# Altium schematic sheet 1.SchDoc
size A0
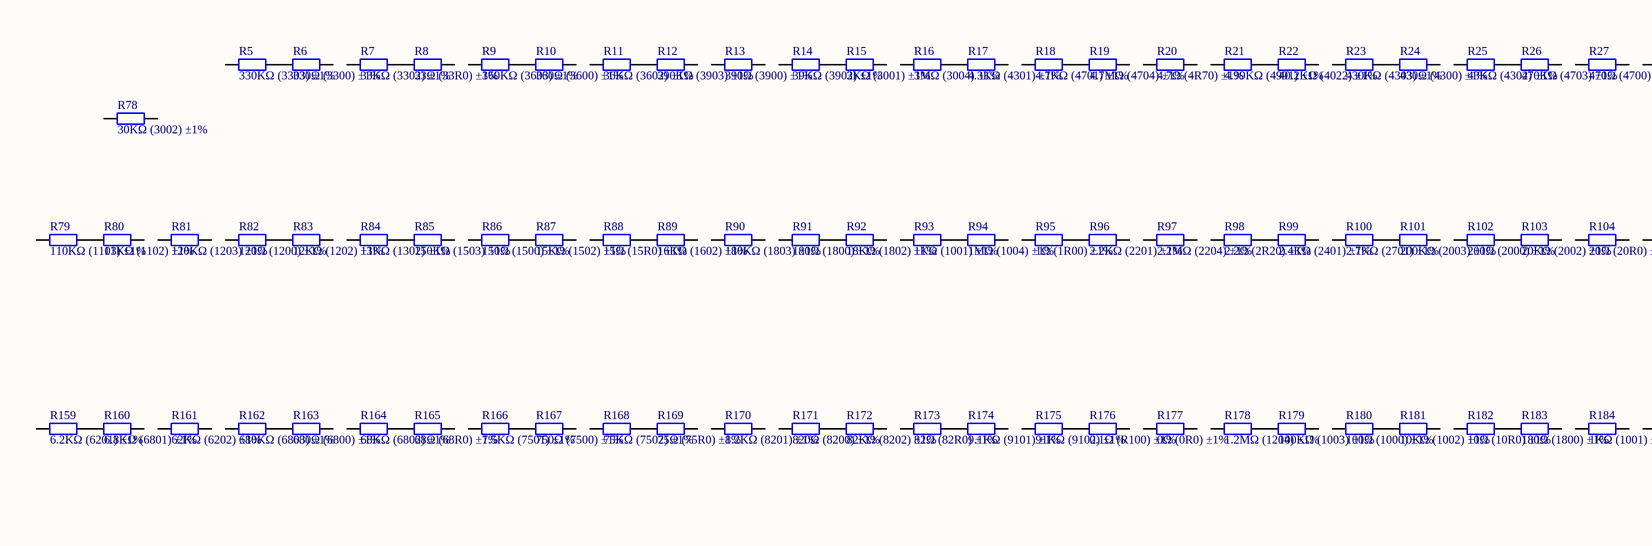
[diagram p0: 1.SchDoc, left]
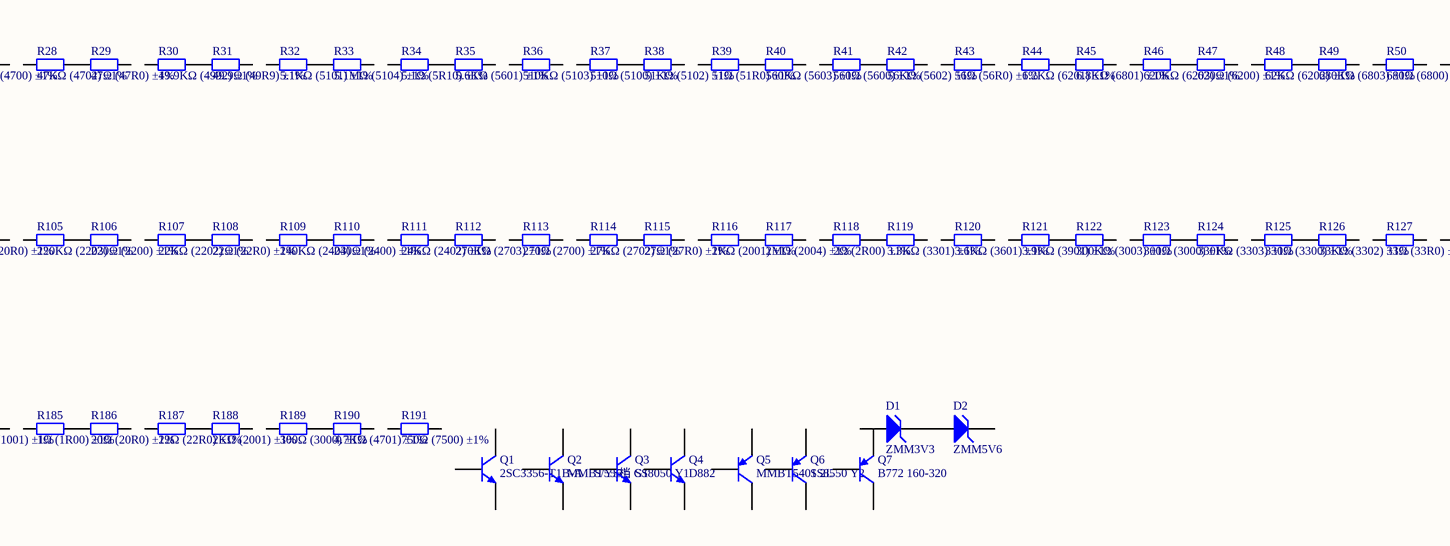
[diagram p1: 1.SchDoc, middle]
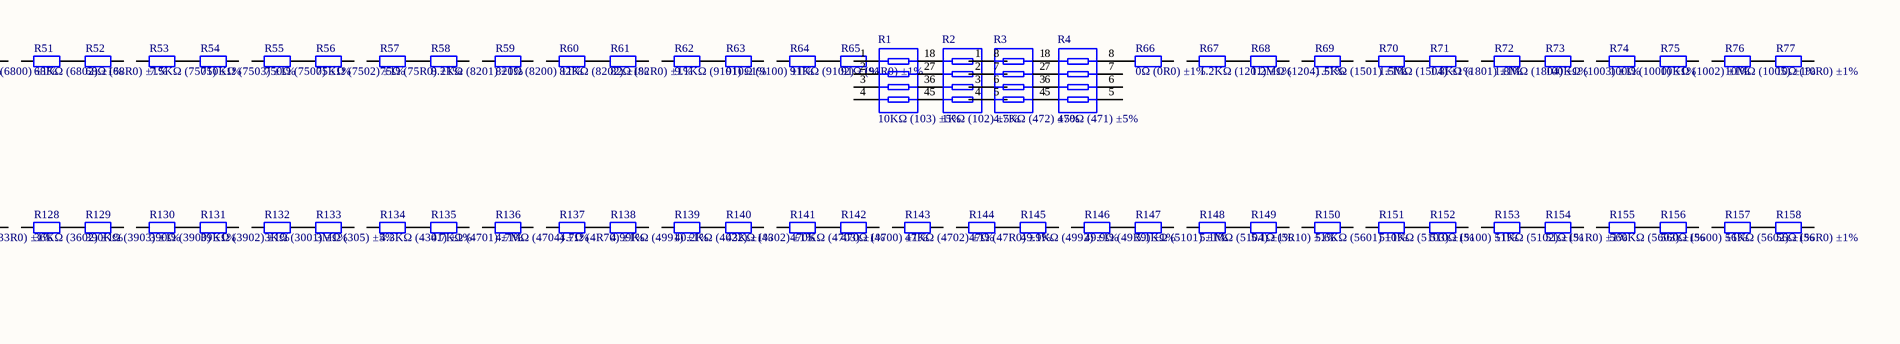
[diagram p2: 1.SchDoc, right]

## Parts
D1  ZMM3V3  [LC-LL-34]
D2  ZMM5V6  [LC-LL-34]
Q1  2SC3356-T1B-A    S/YS档  [LC-SOT-23(SOT-23-3)]
Q2  MMBT5551  G1  [LC-SOT-23(SOT-23-3)]
Q3  SS8050 Y1  [LC-SOT-23(SOT-23-3)]
Q4  D882  [LC-SOT-89(SOT-89-3)]
Q5  MMBT5401 2L  [LC-SOT-23(SOT-23-3)]
Q6  SS8550 Y2  [LC-SOT-23(SOT-23-3)]
Q7  B772 160-320  [LC-SOT-89(SOT-89-3)]
R1  10KΩ (103) ±5%  [LC-0603_Rx4]
R2  1KΩ (102) ±5%  [LC-0603_Rx4]
R3  4.7KΩ (472) ±5%  [LC-0603_Rx4]
R4  470Ω (471) ±5%  [LC-0603_Rx4]
R5  330KΩ (3303) ±1%  [LC-0603_R]
R6  330Ω (3300) ±1%  [LC-0603_R]
R7  33KΩ (3302) ±1%  [LC-0603_R]
R8  33Ω (33R0) ±1%  [LC-0603_R]
R9  360KΩ (3603) ±1%  [LC-0603_R]
R10  360Ω (3600) ±1%  [LC-0603_R]
R11  36KΩ (3602) ±1%  [LC-0603_R]
R12  390KΩ (3903) ±1%  [LC-0603_R]
R13  390Ω (3900) ±1%  [LC-0603_R]
R14  39KΩ (3902) ±1%  [LC-0603_R]
R15  3KΩ (3001) ±1%  [LC-0603_R]
R16  3MΩ (3004) ±1%  [LC-0603_R]
R17  4.3KΩ (4301) ±1%  [LC-0603_R]
R18  4.7KΩ (4701) ±1%  [LC-0603_R]
R19  4.7MΩ (4704) ±1%  [LC-0603_R]
R20  4.7Ω (4R70) ±1%  [LC-0603_R]
R21  4.99KΩ (4991) ±1%  [LC-0603_R]
R22  40.2KΩ (4022) ±1%  [LC-0603_R]
R23  430KΩ (4303) ±1%  [LC-0603_R]
R24  430Ω (4300) ±1%  [LC-0603_R]
R25  43KΩ (4302) ±1%  [LC-0603_R]
R26  470KΩ (4703) ±1%  [LC-0603_R]
R27  470Ω (4700) ±1%  [LC-0603_R]
R28  47KΩ (4702) ±1%  [LC-0603_R]
R29  47Ω (47R0) ±1%  [LC-0603_R]
R30  49.9KΩ (4992) ±1%  [LC-0603_R]
R31  49.9Ω (49R9) ±1%  [LC-0603_R]
R32  5.1KΩ (5101) ±1%  [LC-0603_R]
R33  5.1MΩ (5104) ±1%  [LC-0603_R]
R34  5.1Ω (5R10) ±1%  [LC-0603_R]
R35  5.6KΩ (5601) ±1%  [LC-0603_R]
R36  510KΩ (5103) ±1%  [LC-0603_R]
R37  510Ω (5100) ±1%  [LC-0603_R]
R38  51KΩ (5102) ±1%  [LC-0603_R]
R39  51Ω (51R0) ±1%  [LC-0603_R]
R40  560KΩ (5603) ±1%  [LC-0603_R]
R41  560Ω (5600) ±1%  [LC-0603_R]
R42  56KΩ (5602) ±1%  [LC-0603_R]
R43  56Ω (56R0) ±1%  [LC-0603_R]
R44  6.2KΩ (6201) ±1%  [LC-0603_R]
R45  6.8KΩ (6801) ±1%  [LC-0603_R]
R46  620KΩ (6203) ±1%  [LC-0603_R]
R47  620Ω (6200) ±1%  [LC-0603_R]
R48  62KΩ (6202) ±1%  [LC-0603_R]
R49  680KΩ (6803) ±1%  [LC-0603_R]
R50  680Ω (6800) ±1%  [LC-0603_R]
R51  68KΩ (6802) ±1%  [LC-0603_R]
R52  68Ω (68R0) ±1%  [LC-0603_R]
R53  7.5KΩ (7501) ±1%  [LC-0603_R]
R54  750KΩ (7503) ±1%  [LC-0603_R]
R55  750Ω (7500) ±1%  [LC-0603_R]
R56  75KΩ (7502) ±1%  [LC-0603_R]
R57  75Ω (75R0) ±1%  [LC-0603_R]
R58  8.2KΩ (8201) ±1%  [LC-0603_R]
R59  820Ω (8200) ±1%  [LC-0603_R]
R60  82KΩ (8202) ±1%  [LC-0603_R]
R61  82Ω (82R0) ±1%  [LC-0603_R]
R62  9.1KΩ (9101) ±1%  [LC-0603_R]
R63  910Ω (9100) ±1%  [LC-0603_R]
R64  91KΩ (9102) ±1%  [LC-0603_R]
R65  91Ω (91R0) ±1%  [LC-0603_R]
R66  0Ω (0R0) ±1%  [LC-0805_R]
R67  1.2KΩ (1201) ±1%  [LC-0805_R]
R68  1.2MΩ (1204) ±1%  [LC-0805_R]
R69  1.5KΩ (1501) ±1%  [LC-0805_R]
R70  1.5MΩ (1504) ±1%  [LC-0805_R]
R71  1.8KΩ (1801) ±1%  [LC-0805_R]
R72  1.8MΩ (1804) ±1%  [LC-0805_R]
R73  100KΩ (1003) ±1%  [LC-0805_R]
R74  100Ω (1000) ±1%  [LC-0805_R]
R75  10KΩ (1002) ±1%  [LC-0805_R]
R76  10MΩ (1005) ±1%  [LC-0805_R]
R77  10Ω (10R0) ±1%  [LC-0805_R]
R78  30KΩ (3002) ±1%  [LC-0603_R]
R79  110KΩ (1103) ±1%  [LC-0805_R]
R80  11KΩ (1102) ±1%  [LC-0805_R]
R81  120KΩ (1203) ±1%  [LC-0805_R]
R82  120Ω (1200) ±1%  [LC-0805_R]
R83  12KΩ (1202) ±1%  [LC-0805_R]
R84  13KΩ (1302) ±1%  [LC-0805_R]
R85  150KΩ (1503) ±1%  [LC-0805_R]
R86  150Ω (1500) ±1%  [LC-0805_R]
R87  15KΩ (1502) ±1%  [LC-0805_R]
R88  15Ω (15R0) ±1%  [LC-0805_R]
R89  16KΩ (1602) ±1%  [LC-0805_R]
R90  180KΩ (1803) ±1%  [LC-0805_R]
R91  180Ω (1800) ±1%  [LC-0805_R]
R92  18KΩ (1802) ±1%  [LC-0805_R]
R93  1KΩ (1001) ±1%  [LC-0805_R]
R94  1MΩ (1004) ±1%  [LC-0805_R]
R95  1Ω (1R00) ±1%  [LC-0805_R]
R96  2.2KΩ (2201) ±1%  [LC-0805_R]
R97  2.2MΩ (2204) ±1%  [LC-0805_R]
R98  2.2Ω (2R20) ±1%  [LC-0805_R]
R99  2.4KΩ (2401) ±1%  [LC-0805_R]
R100  2.7KΩ (2701) ±1%  [LC-0805_R]
R101  200KΩ (2003) ±1%  [LC-0805_R]
R102  200Ω (2000) ±1%  [LC-0805_R]
R103  20KΩ (2002) ±1%  [LC-0805_R]
R104  20Ω (20R0) ±1%  [LC-0805_R]
R105  220KΩ (2203) ±1%  [LC-0805_R]
R106  220Ω (2200) ±1%  [LC-0805_R]
R107  22KΩ (2202) ±1%  [LC-0805_R]
R108  22Ω (22R0) ±1%  [LC-0805_R]
R109  240KΩ (2403) ±1%  [LC-0805_R]
R110  240Ω (2400) ±1%  [LC-0805_R]
R111  24KΩ (2402) ±1%  [LC-0805_R]
R112  270KΩ (2703) ±1%  [LC-0805_R]
R113  270Ω (2700) ±1%  [LC-0805_R]
R114  27KΩ (2702) ±1%  [LC-0805_R]
R115  27Ω (27R0) ±1%  [LC-0805_R]
R116  2KΩ (2001) ±1%  [LC-0805_R]
R117  2MΩ (2004) ±1%  [LC-0805_R]
R118  2Ω (2R00) ±1%  [LC-0805_R]
R119  3.3KΩ (3301) ±1%  [LC-0805_R]
R120  3.6KΩ (3601) ±1%  [LC-0805_R]
R121  3.9KΩ (3901) ±1%  [LC-0805_R]
R122  300KΩ (3003) ±1%  [LC-0805_R]
R123  300Ω (3000) ±1%  [LC-0805_R]
R124  330KΩ (3303) ±1%  [LC-0805_R]
R125  330Ω (3300) ±1%  [LC-0805_R]
R126  33KΩ (3302) ±1%  [LC-0805_R]
R127  33Ω (33R0) ±1%  [LC-0805_R]
R128  36KΩ (3602) ±1%  [LC-0805_R]
R129  390KΩ (3903) ±1%  [LC-0805_R]
R130  390Ω (3900) ±1%  [LC-0805_R]
R131  39KΩ (3902) ±1%  [LC-0805_R]
R132  3KΩ (3001) ±1%  [LC-0805_R]
R133  3MΩ (305) ±5%  [LC-0805_R]
R134  4.3KΩ (4301) ±1%  [LC-0805_R]
R135  4.7KΩ (4701) ±1%  [LC-0805_R]
R136  4.7MΩ (4704) ±1%  [LC-0805_R]
R137  4.7Ω (4R70) ±1%  [LC-0805_R]
R138  4.99KΩ (4991) ±1%  [LC-0805_R]
R139  40.2KΩ (4022) ±1%  [LC-0805_R]
R140  43KΩ (4302) ±1%  [LC-0805_R]
R141  470KΩ (4703) ±1%  [LC-0805_R]
R142  470Ω (4700) ±1%  [LC-0805_R]
R143  47KΩ (4702) ±1%  [LC-0805_R]
R144  47Ω (47R0) ±1%  [LC-0805_R]
R145  49.9KΩ (4992) ±1%  [LC-0805_R]
R146  49.9Ω (49R9) ±1%  [LC-0805_R]
R147  5.1KΩ (5101) ±1%  [LC-0805_R]
R148  5.1MΩ (5104) ±1%  [LC-0805_R]
R149  5.1Ω (5R10) ±1%  [LC-0805_R]
R150  5.6KΩ (5601) ±1%  [LC-0805_R]
R151  510KΩ (5103) ±1%  [LC-0805_R]
R152  510Ω (5100) ±1%  [LC-0805_R]
R153  51KΩ (5102) ±1%  [LC-0805_R]
R154  51Ω (51R0) ±1%  [LC-0805_R]
R155  560KΩ (5603) ±1%  [LC-0805_R]
R156  560Ω (5600) ±1%  [LC-0805_R]
R157  56KΩ (5602) ±1%  [LC-0805_R]
R158  56Ω (56R0) ±1%  [LC-0805_R]
R159  6.2KΩ (6201) ±1%  [LC-0805_R]
R160  6.8KΩ (6801) ±1%  [LC-0805_R]
R161  62KΩ (6202) ±1%  [LC-0805_R]
R162  680KΩ (6803) ±1%  [LC-0805_R]
R163  680Ω (6800) ±1%  [LC-0805_R]
R164  68KΩ (6802) ±1%  [LC-0805_R]
R165  68Ω (68R0) ±1%  [LC-0805_R]
R166  7.5KΩ (7501) ±1%  [LC-0805_R]
R167  750Ω (7500) ±1%  [LC-0805_R]
R168  75KΩ (7502) ±1%  [LC-0805_R]
R169  75Ω (75R0) ±1%  [LC-0805_R]
R170  8.2KΩ (8201) ±1%  [LC-0805_R]
R171  820Ω (8200) ±1%  [LC-0805_R]
R172  82KΩ (8202) ±1%  [LC-0805_R]
R173  82Ω (82R0) ±1%  [LC-0805_R]
R174  9.1KΩ (9101) ±1%  [LC-0805_R]
R175  91KΩ (9102) ±1%  [LC-0805_R]
R176  0.1Ω (R100) ±1%  [LC-1206_R]
R177  0Ω (0R0) ±1%  [LC-1206_R]
R178  1.2MΩ (1204) ±1%  [LC-1206_R]
R179  100KΩ (1003) ±1%  [LC-1206_R]
R180  100Ω (1000) ±1%  [LC-1206_R]
R181  10KΩ (1002) ±1%  [LC-1206_R]
R182  10Ω (10R0) ±1%  [LC-1206_R]
R183  180Ω (1800) ±1%  [LC-1206_R]
R184  1KΩ (1001) ±1%  [LC-1206_R]
R185  1Ω (1R00) ±1%  [LC-1206_R]
R186  20Ω (20R0) ±1%  [LC-1206_R]
R187  22Ω (22R0) ±1%  [LC-1206_R]
R188  2KΩ (2001) ±1%  [LC-1206_R]
R189  300Ω (3000) ±1%  [LC-1206_R]
R190  4.7KΩ (4701) ±1%  [LC-1206_R]
R191  750Ω (7500) ±1%  [LC-1206_R]

## Nets
NetD1_2: D1.2(K) D2.1(A)
NetR4_8: R4.8 R66.1
NetR5_2: R5.2 R6.1
NetR7_2: R7.2 R8.1
NetR9_2: R9.2 R10.1
NetR11_2: R11.2 R12.1
NetR14_2: R14.2 R15.1
NetR16_2: R16.2 R17.1
NetR18_2: R18.2 R19.1
NetR21_2: R21.2 R22.1
NetR23_2: R23.2 R24.1
NetR25_2: R25.2 R26.1
NetR28_2: R28.2 R29.1
NetR30_2: R30.2 R31.1
NetR32_2: R32.2 R33.1
NetR34_2: R34.2 R35.1
NetR37_2: R37.2 R38.1
NetR39_2: R39.2 R40.1
NetR41_2: R41.2 R42.1
NetR44_2: R44.2 R45.1
NetR46_2: R46.2 R47.1
NetR48_2: R48.2 R49.1
NetR51_2: R51.2 R52.1
NetR53_2: R53.2 R54.1
NetR55_2: R55.2 R56.1
NetR57_2: R57.2 R58.1
NetR60_2: R60.2 R61.1
NetR62_2: R62.2 R63.1
NetR64_2: R64.2 R65.1
NetR67_2: R67.2 R68.1
NetR70_2: R70.2 R71.1
NetR72_2: R72.2 R73.1
NetR74_2: R74.2 R75.1
NetR76_2: R76.2 R77.1
NetR79_2: R79.2 R80.1
NetR82_2: R82.2 R83.1
NetR84_2: R84.2 R85.1
NetR86_2: R86.2 R87.1
NetR88_2: R88.2 R89.1
NetR91_2: R91.2 R92.1
NetR93_2: R93.2 R94.1
NetR95_2: R95.2 R96.1
NetR98_2: R98.2 R99.1
NetR100_2: R100.2 R101.1
NetR102_2: R102.2 R103.1
NetR105_2: R105.2 R106.1
NetR107_2: R107.2 R108.1
NetR109_2: R109.2 R110.1
NetR111_2: R111.2 R112.1
NetR114_2: R114.2 R115.1
NetR116_2: R116.2 R117.1
NetR118_2: R118.2 R119.1
NetR121_2: R121.2 R122.1
NetR123_2: R123.2 R124.1
NetR125_2: R125.2 R126.1
NetR128_2: R128.2 R129.1
NetR130_2: R130.2 R131.1
NetR132_2: R132.2 R133.1
NetR134_2: R134.2 R135.1
NetR137_2: R137.2 R138.1
NetR139_2: R139.2 R140.1
NetR141_2: R141.2 R142.1
NetR144_2: R144.2 R145.1
NetR146_2: R146.2 R147.1
NetR148_2: R148.2 R149.1
NetR151_2: R151.2 R152.1
NetR153_2: R153.2 R154.1
NetR155_2: R155.2 R156.1
NetR157_2: R157.2 R158.1
NetR159_2: R159.2 R160.1
NetR162_2: R162.2 R163.1
NetR164_2: R164.2 R165.1
NetR166_2: R166.2 R167.1
NetR168_2: R168.2 R169.1
NetR171_2: R171.2 R172.1
NetR173_2: R173.2 R174.1
NetR175_2: R175.2 R176.1
NetR178_2: R178.2 R179.1
NetR180_2: R180.2 R181.1
NetR182_2: R182.2 R183.1
NetR185_2: R185.2 R186.1
NetR187_2: R187.2 R188.1
NetR189_2: R189.2 R190.1

Not connected (* = marked no-connect by the designer): D1 1(A); D2 2(K); Q1 1(B) 2(E) 3(C); Q2 1(B) 2(E) 3(C); Q3 1(B) 2(E) 3(C); Q4 1(B) 2(C) 3(E); Q5 1(B) 2(E) 3(C); Q6 1(B) 2(E) 3(C); Q7 1(B) 2(C) 3(E); R1 1 2 3 4 5 6 7 8; R2 1 2 3 4 5 6 7 8; R3 1 2 3 4 5 6 7 8; R4 1 2 3 4 5 6 7; R5 1; R6 2; R7 1; R8 2; R9 1; R10 2; R11 1; R12 2; R13 1 2; R14 1; R15 2; R16 1; R17 2; R18 1; R19 2; R20 1 2; R21 1; R22 2; R23 1; R24 2; R25 1; R26 2; R27 1 2; R28 1; R29 2; R30 1; R31 2; R32 1; R33 2; R34 1; R35 2; R36 1 2; R37 1; R38 2; R39 1; R40 2; R41 1; R42 2; R43 1 2; R44 1; R45 2; R46 1; R47 2; R48 1; R49 2; R50 1 2; R51 1; R52 2; R53 1; R54 2; R55 1; R56 2; R57 1; R58 2; R59 1 2; R60 1; R61 2; R62 1; R63 2; R64 1; R65 2; R66 2; R67 1; R68 2; R69 1 2; R70 1; R71 2; R72 1; R73 2; R74 1; R75 2; R76 1; R77 2; R78 1 2; R79 1; R80 2; R81 1 2; R82 1; R83 2; R84 1; R85 2; R86 1; R87 2; R88 1; R89 2; R90 1 2; R91 1; R92 2; R93 1; R94 2; R95 1; R96 2; R97 1 2; R98 1; R99 2; R100 1; R101 2; R102 1; R103 2; R104 1 2; R105 1; R106 2; R107 1; R108 2; R109 1; R110 2; R111 1; R112 2; R113 1 2; R114 1; R115 2; R116 1; R117 2; R118 1; R119 2; R120 1 2; R121 1; R122 2; R123 1; R124 2; R125 1; R126 2; R127 1 2; R128 1; R129 2; R130 1; R131 2; R132 1; R133 2; R134 1; R135 2; R136 1 2; R137 1; R138 2; R139 1; R140 2; R141 1; R142 2; R143 1 2; R144 1; R145 2; R146 1; R147 2; R148 1; R149 2; R150 1 2; R151 1; R152 2; R153 1; R154 2; R155 1; R156 2; R157 1; R158 2; R159 1; R160 2; R161 1 2; R162 1; R163 2; R164 1; R165 2; R166 1; R167 2; R168 1; R169 2; R170 1 2; R171 1; R172 2; R173 1; R174 2; R175 1; R176 2; R177 1 2; R178 1; R179 2; R180 1; R181 2; R182 1; R183 2; R184 1 2; R185 1; R186 2; R187 1; R188 2; R189 1; R190 2; R191 1 2

## Library data of the parts
D1 = LL-34 ZMM3V3: 稳压二极管; ComponentLink1Description: 供应商链接; ComponentLink1URL: http://www.szlcsc.com/product/details_8535.html; Package: LL-34; Supplier: LC; SuppliersPartNumber: C8056
D2 = LL-34 ZMM5V6: 稳压二极管; ComponentLink1Description: 供应商链接; ComponentLink1URL: http://www.szlcsc.com/product/details_8541.html; Package: LL-34; Supplier: LC; SuppliersPartNumber: C8062
Q1 = SOT-23 2SC3356-T1B-A    S/YS档: 三极管; ComponentLink1Description: 供应商链接; ComponentLink1URL: http://www.szlcsc.com/product/details_10189.html; Package: SOT-23; Supplier: LC; SuppliersPartNumber: C9659
Q2 = SOT-23 MMBT5551  G1: 三极管; ComponentLink1Description: 供应商链接; ComponentLink1URL: http://www.szlcsc.com/product/details_2502.html; Package: SOT-23; Supplier: LC; SuppliersPartNumber: C2145
Q3 = SOT-23 SS8050 Y1: 三极管; ComponentLink1Description: 供应商链接; ComponentLink1URL: http://www.szlcsc.com/product/details_2507.html; Package: SOT-23; Supplier: LC; SuppliersPartNumber: C2150
Q4 = SOT-89 D882: 三极管; ComponentLink1Description: 供应商链接; ComponentLink1URL: http://www.szlcsc.com/product/details_10164.html; Package: SOT-89; Supplier: LC; SuppliersPartNumber: C9634
Q5 = SOT-23 MMBT5401 2L: 三极管; ComponentLink1Description: 供应商链接; ComponentLink1URL: http://www.szlcsc.com/product/details_8818.html; Package: SOT-23; Supplier: LC; SuppliersPartNumber: C8326
Q6 = SOT-23 SS8550 Y2: 三极管; ComponentLink1Description: 供应商链接; ComponentLink1URL: http://www.szlcsc.com/product/details_9037.html; Package: SOT-23; Supplier: LC; SuppliersPartNumber: C8542
Q7 = SOT-89 B772 160-320: 三极管; ComponentLink1Description: 供应商链接; ComponentLink1URL: http://www.szlcsc.com/product/details_25018.html; Package: SOT-89; Supplier: LC; SuppliersPartNumber: C24278
R1 = 0603*4  10KΩ (103) 5%: 贴片排阻; ComponentLink1Description: 供应商链接; ComponentLink1URL: http://www.szlcsc.com/product/details_30472.html; Package: 0603*4; Supplier: LC; SuppliersPartNumber: C29718
R2 = 0603*4  1KΩ (102) 5%: 贴片排阻; ComponentLink1Description: 供应商链接; ComponentLink1URL: http://www.szlcsc.com/product/details_20907.html; Package: 0603*4; Supplier: LC; SuppliersPartNumber: C20197
R3 = 0603*4  4.7KΩ (472) 5%: 贴片排阻; ComponentLink1Description: 供应商链接; ComponentLink1URL: http://www.szlcsc.com/product/details_2332.html; Package: 0603*4; Supplier: LC; SuppliersPartNumber: C1980
R4 = 0603*4 470Ω (471) 5%: 贴片排阻; ComponentLink1Description: 供应商链接; ComponentLink1URL: http://www.szlcsc.com/product/details_26253.html; Package: 0603*4; Supplier: LC; SuppliersPartNumber: C25510
R5 = 0603 330KΩ (3303) 1%: 贴片电阻; ComponentLink1Description: 供应商链接; ComponentLink1URL: http://www.szlcsc.com/product/details_23864.html; Package: 0603; Supplier: LC; SuppliersPartNumber: C23137
R6 = 0603 330Ω (3300) 1%: 贴片电阻; ComponentLink1Description: 供应商链接; ComponentLink1URL: http://www.szlcsc.com/product/details_23865.html; Package: 0603; Supplier: LC; SuppliersPartNumber: C23138
R7 = 0603 33KΩ (3302) 1%: 贴片电阻; ComponentLink1Description: 供应商链接; ComponentLink1URL: http://www.szlcsc.com/product/details_4623.html; Package: 0603; Supplier: LC; SuppliersPartNumber: C4216
R8 = 0603 33Ω (33R0) 1%: 贴片电阻; ComponentLink1Description: 供应商链接; ComponentLink1URL: http://www.szlcsc.com/product/details_23867.html; Package: 0603; Supplier: LC; SuppliersPartNumber: C23140
R9 = 0603 360KΩ (3603) 1%: 贴片电阻; ComponentLink1Description: 供应商链接; ComponentLink1URL: http://www.szlcsc.com/product/details_23873.html; Package: 0603; Supplier: LC; SuppliersPartNumber: C23146
R10 = 0603 360Ω (3600) 1%: 贴片电阻; ComponentLink1Description: 供应商链接; ComponentLink1URL: http://www.szlcsc.com/product/details_25937.html; Package: 0603; Supplier: LC; SuppliersPartNumber: C25194
R11 = 0603 36KΩ (3602) 1%: 贴片电阻; ComponentLink1Description: 供应商链接; ComponentLink1URL: http://www.szlcsc.com/product/details_23874.html; Package: 0603; Supplier: LC; SuppliersPartNumber: C23147
R12 = 0603 390KΩ (3903) 1%: 贴片电阻; ComponentLink1Description: 供应商链接; ComponentLink1URL: http://www.szlcsc.com/product/details_23877.html; Package: 0603; Supplier: LC; SuppliersPartNumber: C23150
R13 = 0603 390Ω (3900) 1%: 贴片电阻; ComponentLink1Description: 供应商链接; ComponentLink1URL: http://www.szlcsc.com/product/details_23878.html; Package: 0603; Supplier: LC; SuppliersPartNumber: C23151
R14 = 0603 39KΩ (3902) 1%: 贴片电阻; ComponentLink1Description: 供应商链接; ComponentLink1URL: http://www.szlcsc.com/product/details_23880.html; Package: 0603; Supplier: LC; SuppliersPartNumber: C23153
R15 = 0603 3KΩ (3001) 1%: 贴片电阻; ComponentLink1Description: 供应商链接; ComponentLink1URL: http://www.szlcsc.com/product/details_4618.html; Package: 0603; Supplier: LC; SuppliersPartNumber: C4211
R16 = 0603 3MΩ (3004) 1%: 贴片电阻; ComponentLink1Description: 供应商链接; ComponentLink1URL: http://www.szlcsc.com/product/details_23883.html; Package: 0603; Supplier: LC; SuppliersPartNumber: C23156
R17 = 0603 4.3KΩ (4301) 1%: 贴片电阻; ComponentLink1Description: 供应商链接; ComponentLink1URL: http://www.szlcsc.com/product/details_23886.html; Package: 0603; Supplier: LC; SuppliersPartNumber: C23159
R18 = 0603 4.7KΩ (4701) 1%: 贴片电阻; ComponentLink1Description: 供应商链接; ComponentLink1URL: http://www.szlcsc.com/product/details_23889.html; Package: 0603; Supplier: LC; SuppliersPartNumber: C23162
R19 = 0603 4.7MΩ (4704) 1%: 贴片电阻; ComponentLink1Description: 供应商链接; ComponentLink1URL: http://www.szlcsc.com/product/details_23890.html; Package: 0603; Supplier: LC; SuppliersPartNumber: C23163
R20 = 0603 4.7Ω (4R70) 1%: 贴片电阻; ComponentLink1Description: 供应商链接; ComponentLink1URL: http://www.szlcsc.com/product/details_23891.html; Package: 0603; Supplier: LC; SuppliersPartNumber: C23164
R21 = 0603 4.99KΩ (4991) 1%: 贴片电阻; ComponentLink1Description: 供应商链接; ComponentLink1URL: http://www.szlcsc.com/product/details_23773.html; Package: 0603; Supplier: LC; SuppliersPartNumber: C23046
R22 = 0603 40.2KΩ (4022) 1%: 贴片电阻; ComponentLink1Description: 供应商链接; ComponentLink1URL: http://www.szlcsc.com/product/details_13081.html; Package: 0603; Supplier: LC; SuppliersPartNumber: C12447
R23 = 0603 430KΩ (4303) 1%: 贴片电阻; ComponentLink1Description: 供应商链接; ComponentLink1URL: http://www.szlcsc.com/product/details_26712.html; Package: 0603; Supplier: LC; SuppliersPartNumber: C25969
R24 = 0603 430Ω (4300) 1%: 贴片电阻; ComponentLink1Description: 供应商链接; ComponentLink1URL: http://www.szlcsc.com/product/details_23897.html; Package: 0603; Supplier: LC; SuppliersPartNumber: C23170
R25 = 0603 43KΩ (4302) 1%: 贴片电阻; ComponentLink1Description: 供应商链接; ComponentLink1URL: http://www.szlcsc.com/product/details_23899.html; Package: 0603; Supplier: LC; SuppliersPartNumber: C23172
R26 = 0603 470KΩ (4703) 1%: 贴片电阻; ComponentLink1Description: 供应商链接; ComponentLink1URL: http://www.szlcsc.com/product/details_23905.html; Package: 0603; Supplier: LC; SuppliersPartNumber: C23178
R27 = 0603 470Ω (4700) 1%: 贴片电阻; ComponentLink1Description: 供应商链接; ComponentLink1URL: http://www.szlcsc.com/product/details_23906.html; Package: 0603; Supplier: LC; SuppliersPartNumber: C23179
R28 = 0603 47KΩ (4702) 1%: 贴片电阻; ComponentLink1Description: 供应商链接; ComponentLink1URL: http://www.szlcsc.com/product/details_26562.html; Package: 0603; Supplier: LC; SuppliersPartNumber: C25819
R29 = 0603 47Ω (47R0) 1%: 贴片电阻; ComponentLink1Description: 供应商链接; ComponentLink1URL: http://www.szlcsc.com/product/details_23909.html; Package: 0603; Supplier: LC; SuppliersPartNumber: C23182
R30 = 0603 49.9KΩ (4992) 1%: 贴片电阻; ComponentLink1Description: 供应商链接; ComponentLink1URL: http://www.szlcsc.com/product/details_23911.html; Package: 0603; Supplier: LC; SuppliersPartNumber: C23184
R31 = 0603 49.9Ω (49R9) 1%: 贴片电阻; ComponentLink1Description: 供应商链接; ComponentLink1URL: http://www.szlcsc.com/product/details_23912.html; Package: 0603; Supplier: LC; SuppliersPartNumber: C23185
R32 = 0603 5.1KΩ (5101) 1%: 贴片电阻; ComponentLink1Description: 供应商链接; ComponentLink1URL: http://www.szlcsc.com/product/details_23913.html; Package: 0603; Supplier: LC; SuppliersPartNumber: C23186
R33 = 0603 5.1MΩ (5104) 1%: 贴片电阻; ComponentLink1Description: 供应商链接; ComponentLink1URL: http://www.szlcsc.com/product/details_13967.html; Package: 0603; Supplier: LC; SuppliersPartNumber: C13320
R34 = 0603 5.1Ω (5R10) 1%: 贴片电阻; ComponentLink1Description: 供应商链接; ComponentLink1URL: http://www.szlcsc.com/product/details_25940.html; Package: 0603; Supplier: LC; SuppliersPartNumber: C25197
R35 = 0603 5.6KΩ (5601) 1%: 贴片电阻; ComponentLink1Description: 供应商链接; ComponentLink1URL: http://www.szlcsc.com/product/details_23916.html; Package: 0603; Supplier: LC; SuppliersPartNumber: C23189
R36 = 0603 510KΩ (5103) 1%: 贴片电阻; ComponentLink1Description: 供应商链接; ComponentLink1URL: http://www.szlcsc.com/product/details_23919.html; Package: 0603; Supplier: LC; SuppliersPartNumber: C23192
R37 = 0603 510Ω (5100) 1%: 贴片电阻; ComponentLink1Description: 供应商链接; ComponentLink1URL: http://www.szlcsc.com/product/details_23920.html; Package: 0603; Supplier: LC; SuppliersPartNumber: C23193
R38 = 0603 51KΩ (5102) 1%: 贴片电阻; ComponentLink1Description: 供应商链接; ComponentLink1URL: http://www.szlcsc.com/product/details_23923.html; Package: 0603; Supplier: LC; SuppliersPartNumber: C23196
R39 = 0603 51Ω (51R0) 1%: 贴片电阻; ComponentLink1Description: 供应商链接; ComponentLink1URL: http://www.szlcsc.com/product/details_23924.html; Package: 0603; Supplier: LC; SuppliersPartNumber: C23197
R40 = 0603 560KΩ (5603) 1%: 贴片电阻; ComponentLink1Description: 供应商链接; ComponentLink1URL: http://www.szlcsc.com/product/details_23930.html; Package: 0603; Supplier: LC; SuppliersPartNumber: C23203
R41 = 0603 560Ω (5600) 1%: 贴片电阻; ComponentLink1Description: 供应商链接; ComponentLink1URL: http://www.szlcsc.com/product/details_23931.html; Package: 0603; Supplier: LC; SuppliersPartNumber: C23204
R42 = 0603 56KΩ (5602) 1%: 贴片电阻; ComponentLink1Description: 供应商链接; ComponentLink1URL: http://www.szlcsc.com/product/details_23933.html; Package: 0603; Supplier: LC; SuppliersPartNumber: C23206
R43 = 0603 56Ω (56R0) 1%: 贴片电阻; ComponentLink1Description: 供应商链接; ComponentLink1URL: http://www.szlcsc.com/product/details_25939.html; Package: 0603; Supplier: LC; SuppliersPartNumber: C25196
R44 = 0603 6.2KΩ (6201) 1%: 贴片电阻; ComponentLink1Description: 供应商链接; ComponentLink1URL: http://www.szlcsc.com/product/details_4667.html; Package: 0603; Supplier: LC; SuppliersPartNumber: C4260
R45 = 0603 6.8KΩ (6801) 1%: 贴片电阻; ComponentLink1Description: 供应商链接; ComponentLink1URL: http://www.szlcsc.com/product/details_23939.html; Package: 0603; Supplier: LC; SuppliersPartNumber: C23212
R46 = 0603 620KΩ (6203) 1%: 贴片电阻; ComponentLink1Description: 供应商链接; ComponentLink1URL: http://www.szlcsc.com/product/details_23946.html; Package: 0603; Supplier: LC; SuppliersPartNumber: C23219
R47 = 0603 620Ω (6200) 1%: 贴片电阻; ComponentLink1Description: 供应商链接; ComponentLink1URL: http://www.szlcsc.com/product/details_23947.html; Package: 0603; Supplier: LC; SuppliersPartNumber: C23220
R48 = 0603 62KΩ (6202) 1%: 贴片电阻; ComponentLink1Description: 供应商链接; ComponentLink1URL: http://www.szlcsc.com/product/details_23948.html; Package: 0603; Supplier: LC; SuppliersPartNumber: C23221
R49 = 0603 680KΩ (6803) 1%: 贴片电阻; ComponentLink1Description: 供应商链接; ComponentLink1URL: http://www.szlcsc.com/product/details_26565.html; Package: 0603; Supplier: LC; SuppliersPartNumber: C25822
R50 = 0603 680Ω (6800) 1%: 贴片电阻; ComponentLink1Description: 供应商链接; ComponentLink1URL: http://www.szlcsc.com/product/details_23955.html; Package: 0603; Supplier: LC; SuppliersPartNumber: C23228
R51 = 0603 68KΩ (6802) 1%: 贴片电阻; ComponentLink1Description: 供应商链接; ComponentLink1URL: http://www.szlcsc.com/product/details_23958.html; Package: 0603; Supplier: LC; SuppliersPartNumber: C23231
R52 = 0603 68Ω (68R0) 1%: 贴片电阻; ComponentLink1Description: 供应商链接; ComponentLink1URL: http://www.szlcsc.com/product/details_28341.html; Package: 0603; Supplier: LC; SuppliersPartNumber: C27592
R53 = 0603 7.5KΩ (7501) 1%: 贴片电阻; ComponentLink1Description: 供应商链接; ComponentLink1URL: http://www.szlcsc.com/product/details_23961.html; Package: 0603; Supplier: LC; SuppliersPartNumber: C23234
R54 = 0603 750KΩ (7503) 1%: 贴片电阻; ComponentLink1Description: 供应商链接; ComponentLink1URL: http://www.szlcsc.com/product/details_23967.html; Package: 0603; Supplier: LC; SuppliersPartNumber: C23240
R55 = 0603 750Ω (7500) 1%: 贴片电阻; ComponentLink1Description: 供应商链接; ComponentLink1URL: http://www.szlcsc.com/product/details_23968.html; Package: 0603; Supplier: LC; SuppliersPartNumber: C23241
R56 = 0603 75KΩ (7502) 1%: 贴片电阻; ComponentLink1Description: 供应商链接; ComponentLink1URL: http://www.szlcsc.com/product/details_23969.html; Package: 0603; Supplier: LC; SuppliersPartNumber: C23242
R57 = 0603 75Ω (75R0) 1%: 贴片电阻; ComponentLink1Description: 供应商链接; ComponentLink1URL: http://www.szlcsc.com/product/details_4682.html; Package: 0603; Supplier: LC; SuppliersPartNumber: C4275
R58 = 0603 8.2KΩ (8201) 1%: 贴片电阻; ComponentLink1Description: 供应商链接; ComponentLink1URL: http://www.szlcsc.com/product/details_26724.html; Package: 0603; Supplier: LC; SuppliersPartNumber: C25981
R59 = 0603 820Ω (8200) 1%: 贴片电阻; ComponentLink1Description: 供应商链接; ComponentLink1URL: http://www.szlcsc.com/product/details_23980.html; Package: 0603; Supplier: LC; SuppliersPartNumber: C23253
R60 = 0603 82KΩ (8202) 1%: 贴片电阻; ComponentLink1Description: 供应商链接; ComponentLink1URL: http://www.szlcsc.com/product/details_23981.html; Package: 0603; Supplier: LC; SuppliersPartNumber: C23254
R61 = 0603 82Ω (82R0) 1%: 贴片电阻; ComponentLink1Description: 供应商链接; ComponentLink1URL: http://www.szlcsc.com/product/details_23982.html; Package: 0603; Supplier: LC; SuppliersPartNumber: C23255
R62 = 0603 9.1KΩ (9101) 1%: 贴片电阻; ComponentLink1Description: 供应商链接; ComponentLink1URL: http://www.szlcsc.com/product/details_23987.html; Package: 0603; Supplier: LC; SuppliersPartNumber: C23260
R63 = 0603 910Ω (9100) 1%: 贴片电阻; ComponentLink1Description: 供应商链接; ComponentLink1URL: http://www.szlcsc.com/product/details_23991.html; Package: 0603; Supplier: LC; SuppliersPartNumber: C23264
R64 = 0603 91KΩ (9102) 1%: 贴片电阻; ComponentLink1Description: 供应商链接; ComponentLink1URL: http://www.szlcsc.com/product/details_23992.html; Package: 0603; Supplier: LC; SuppliersPartNumber: C23265
R65 = 0603 91Ω (91R0) 1%: 贴片电阻; ComponentLink1Description: 供应商链接; ComponentLink1URL: http://www.szlcsc.com/product/details_25942.html; Package: 0603; Supplier: LC; SuppliersPartNumber: C25199
R66 = 0805 0Ω (0R0) 1%: 贴片电阻; ComponentLink1Description: 供应商链接; ComponentLink1URL: http://www.szlcsc.com/product/details_18165.html; Package: 0805; Supplier: LC; SuppliersPartNumber: C17477
R67 = 0805 1.2KΩ (1201) 1%: 贴片电阻; ComponentLink1Description: 供应商链接; ComponentLink1URL: http://www.szlcsc.com/product/details_18067.html; Package: 0805; Supplier: LC; SuppliersPartNumber: C17379
R68 = 0805 1.2MΩ (1204) 1%: 贴片电阻; ComponentLink1Description: 供应商链接; ComponentLink1URL: http://www.szlcsc.com/product/details_18068.html; Package: 0805; Supplier: LC; SuppliersPartNumber: C17380
R69 = 0805 1.5KΩ (1501) 1%: 贴片电阻; ComponentLink1Description: 供应商链接; ComponentLink1URL: http://www.szlcsc.com/product/details_4717.html; Package: 0805; Supplier: LC; SuppliersPartNumber: C4310
R70 = 0805 1.5MΩ (1504) 1%: 贴片电阻; ComponentLink1Description: 供应商链接; ComponentLink1URL: http://www.szlcsc.com/product/details_26853.html; Package: 0805; Supplier: LC; SuppliersPartNumber: C26110
R71 = 0805 1.8KΩ (1801) 1%: 贴片电阻; ComponentLink1Description: 供应商链接; ComponentLink1URL: http://www.szlcsc.com/product/details_18086.html; Package: 0805; Supplier: LC; SuppliersPartNumber: C17398
R72 = 0805 1.8MΩ (1804) 1%: 贴片电阻; ComponentLink1Description: 供应商链接; ComponentLink1URL: http://www.szlcsc.com/product/details_18087.html; Package: 0805; Supplier: LC; SuppliersPartNumber: C17399
R73 = 0805 100KΩ (1003) 1%: 贴片电阻; ComponentLink1Description: 供应商链接; ComponentLink1URL: http://www.szlcsc.com/product/details_18095.html; Package: 0805; Supplier: LC; SuppliersPartNumber: C17407
R74 = 0805 100Ω (1000) 1%: 贴片电阻; ComponentLink1Description: 供应商链接; ComponentLink1URL: http://www.szlcsc.com/product/details_18096.html; Package: 0805; Supplier: LC; SuppliersPartNumber: C17408
R75 = 0805 10KΩ (1002) 1%: 贴片电阻; ComponentLink1Description: 供应商链接; ComponentLink1URL: http://www.szlcsc.com/product/details_18102.html; Package: 0805; Supplier: LC; SuppliersPartNumber: C17414
R76 = 0805 10MΩ (1005) 1%: 贴片电阻; ComponentLink1Description: 供应商链接; ComponentLink1URL: http://www.szlcsc.com/product/details_26851.html; Package: 0805; Supplier: LC; SuppliersPartNumber: C26108
R77 = 0805 10Ω (10R0) 1%: 贴片电阻; ComponentLink1Description: 供应商链接; ComponentLink1URL: http://www.szlcsc.com/product/details_18103.html; Package: 0805; Supplier: LC; SuppliersPartNumber: C17415
R78 = 0603 30KΩ (3002) 1%: 贴片电阻; ComponentLink1Description: 供应商链接; ComponentLink1URL: http://www.szlcsc.com/product/details_23711.html; Package: 0603; Supplier: LC; SuppliersPartNumber: C22984
R79 = 0805 110KΩ (1103) 1%: 贴片电阻; ComponentLink1Description: 供应商链接; ComponentLink1URL: http://www.szlcsc.com/product/details_18110.html; Package: 0805; Supplier: LC; SuppliersPartNumber: C17422
R80 = 0805 11KΩ (1102) 1%: 贴片电阻; ComponentLink1Description: 供应商链接; ComponentLink1URL: http://www.szlcsc.com/product/details_18117.html; Package: 0805; Supplier: LC; SuppliersPartNumber: C17429
R81 = 0805 120KΩ (1203) 1%: 贴片电阻; ComponentLink1Description: 供应商链接; ComponentLink1URL: http://www.szlcsc.com/product/details_18124.html; Package: 0805; Supplier: LC; SuppliersPartNumber: C17436
R82 = 0805 120Ω (1200) 1%: 贴片电阻; ComponentLink1Description: 供应商链接; ComponentLink1URL: http://www.szlcsc.com/product/details_18125.html; Package: 0805; Supplier: LC; SuppliersPartNumber: C17437
R83 = 0805 12KΩ (1202) 1%: 贴片电阻; ComponentLink1Description: 供应商链接; ComponentLink1URL: http://www.szlcsc.com/product/details_18132.html; Package: 0805; Supplier: LC; SuppliersPartNumber: C17444
R84 = 0805 13KΩ (1302) 1%: 贴片电阻; ComponentLink1Description: 供应商链接; ComponentLink1URL: http://www.szlcsc.com/product/details_18143.html; Package: 0805; Supplier: LC; SuppliersPartNumber: C17455
R85 = 0805 150KΩ (1503) 1%: 贴片电阻; ComponentLink1Description: 供应商链接; ComponentLink1URL: http://www.szlcsc.com/product/details_18158.html; Package: 0805; Supplier: LC; SuppliersPartNumber: C17470
R86 = 0805 150Ω (1500) 1%: 贴片电阻; ComponentLink1Description: 供应商链接; ComponentLink1URL: http://www.szlcsc.com/product/details_18159.html; Package: 0805; Supplier: LC; SuppliersPartNumber: C17471
R87 = 0805 15KΩ (1502) 1%: 贴片电阻; ComponentLink1Description: 供应商链接; ComponentLink1URL: http://www.szlcsc.com/product/details_18163.html; Package: 0805; Supplier: LC; SuppliersPartNumber: C17475
R88 = 0805 15Ω (15R0) 1%: 贴片电阻; ComponentLink1Description: 供应商链接; ComponentLink1URL: http://www.szlcsc.com/product/details_18168.html; Package: 0805; Supplier: LC; SuppliersPartNumber: C17480
R89 = 0805 16KΩ (1602) 1%: 贴片电阻; ComponentLink1Description: 供应商链接; ComponentLink1URL: http://www.szlcsc.com/product/details_18178.html; Package: 0805; Supplier: LC; SuppliersPartNumber: C17490
R90 = 0805 180KΩ (1803) 1%: 贴片电阻; ComponentLink1Description: 供应商链接; ComponentLink1URL: http://www.szlcsc.com/product/details_18189.html; Package: 0805; Supplier: LC; SuppliersPartNumber: C17501
R91 = 0805 180Ω (1800) 1%: 贴片电阻; ComponentLink1Description: 供应商链接; ComponentLink1URL: http://www.szlcsc.com/product/details_26013.html; Package: 0805; Supplier: LC; SuppliersPartNumber: C25270
R92 = 0805 18KΩ (1802) 1%: 贴片电阻; ComponentLink1Description: 供应商链接; ComponentLink1URL: http://www.szlcsc.com/product/details_18194.html; Package: 0805; Supplier: LC; SuppliersPartNumber: C17506
R93 = 0805 1KΩ (1001) 1%: 贴片电阻; ComponentLink1Description: 供应商链接; ComponentLink1URL: http://www.szlcsc.com/product/details_18201.html; Package: 0805; Supplier: LC; SuppliersPartNumber: C17513
R94 = 0805 1MΩ (1004) 1%: 贴片电阻; ComponentLink1Description: 供应商链接; ComponentLink1URL: http://www.szlcsc.com/product/details_18202.html; Package: 0805; Supplier: LC; SuppliersPartNumber: C17514
R95 = 0805 1Ω (1R00) 1%: 贴片电阻; ComponentLink1Description: 供应商链接; ComponentLink1URL: http://www.szlcsc.com/product/details_26014.html; Package: 0805; Supplier: LC; SuppliersPartNumber: C25271
R96 = 0805 2.2KΩ (2201) 1%: 贴片电阻; ComponentLink1Description: 供应商链接; ComponentLink1URL: http://www.szlcsc.com/product/details_18208.html; Package: 0805; Supplier: LC; SuppliersPartNumber: C17520
R97 = 0805 2.2MΩ (2204) 1%: 贴片电阻; ComponentLink1Description: 供应商链接; ComponentLink1URL: http://www.szlcsc.com/product/details_26856.html; Package: 0805; Supplier: LC; SuppliersPartNumber: C26113
R98 = 0805 2.2Ω (2R20) 1%: 贴片电阻; ComponentLink1Description: 供应商链接; ComponentLink1URL: http://www.szlcsc.com/product/details_18209.html; Package: 0805; Supplier: LC; SuppliersPartNumber: C17521
R99 = 0805 2.4KΩ (2401) 1%: 贴片电阻; ComponentLink1Description: 供应商链接; ComponentLink1URL: http://www.szlcsc.com/product/details_18214.html; Package: 0805; Supplier: LC; SuppliersPartNumber: C17526
R100 = 0805 2.7KΩ (2701) 1%: 贴片电阻; ComponentLink1Description: 供应商链接; ComponentLink1URL: http://www.szlcsc.com/product/details_18218.html; Package: 0805; Supplier: LC; SuppliersPartNumber: C17530
R101 = 0805 200KΩ (2003) 1%: 贴片电阻; ComponentLink1Description: 供应商链接; ComponentLink1URL: http://www.szlcsc.com/product/details_18227.html; Package: 0805; Supplier: LC; SuppliersPartNumber: C17539
R102 = 0805 200Ω (2000) 1%: 贴片电阻; ComponentLink1Description: 供应商链接; ComponentLink1URL: http://www.szlcsc.com/product/details_18228.html; Package: 0805; Supplier: LC; SuppliersPartNumber: C17540
R103 = 0805 20KΩ (2002) 1%: 贴片电阻; ComponentLink1Description: 供应商链接; ComponentLink1URL: http://www.szlcsc.com/product/details_4735.html; Package: 0805; Supplier: LC; SuppliersPartNumber: C4328
R104 = 0805 20Ω (20R0) 1%: 贴片电阻; ComponentLink1Description: 供应商链接; ComponentLink1URL: http://www.szlcsc.com/product/details_18232.html; Package: 0805; Supplier: LC; SuppliersPartNumber: C17544
R105 = 0805 220KΩ (2203) 1%: 贴片电阻; ComponentLink1Description: 供应商链接; ComponentLink1URL: http://www.szlcsc.com/product/details_18244.html; Package: 0805; Supplier: LC; SuppliersPartNumber: C17556
R106 = 0805 220Ω (2200) 1%: 贴片电阻; ComponentLink1Description: 供应商链接; ComponentLink1URL: http://www.szlcsc.com/product/details_18245.html; Package: 0805; Supplier: LC; SuppliersPartNumber: C17557
R107 = 0805 22KΩ (2202) 1%: 贴片电阻; ComponentLink1Description: 供应商链接; ComponentLink1URL: http://www.szlcsc.com/product/details_18248.html; Package: 0805; Supplier: LC; SuppliersPartNumber: C17560
R108 = 0805 22Ω (22R0) 1%: 贴片电阻; ComponentLink1Description: 供应商链接; ComponentLink1URL: http://www.szlcsc.com/product/details_18249.html; Package: 0805; Supplier: LC; SuppliersPartNumber: C17561
R109 = 0805 240KΩ (2403) 1%: 贴片电阻; ComponentLink1Description: 供应商链接; ComponentLink1URL: http://www.szlcsc.com/product/details_26567.html; Package: 0805; Supplier: LC; SuppliersPartNumber: C25824
R110 = 0805 240Ω (2400) 1%: 贴片电阻; ComponentLink1Description: 供应商链接; ComponentLink1URL: http://www.szlcsc.com/product/details_18260.html; Package: 0805; Supplier: LC; SuppliersPartNumber: C17572
R111 = 0805 24KΩ (2402) 1%: 贴片电阻; ComponentLink1Description: 供应商链接; ComponentLink1URL: http://www.szlcsc.com/product/details_18263.html; Package: 0805; Supplier: LC; SuppliersPartNumber: C17575
R112 = 0805 270KΩ (2703) 1%: 贴片电阻; ComponentLink1Description: 供应商链接; ComponentLink1URL: http://www.szlcsc.com/product/details_18277.html; Package: 0805; Supplier: LC; SuppliersPartNumber: C17589
R113 = 0805 270Ω (2700) 1%: 贴片电阻; ComponentLink1Description: 供应商链接; ComponentLink1URL: http://www.szlcsc.com/product/details_18278.html; Package: 0805; Supplier: LC; SuppliersPartNumber: C17590
R114 = 0805 27KΩ (2702) 1%: 贴片电阻; ComponentLink1Description: 供应商链接; ComponentLink1URL: http://www.szlcsc.com/product/details_18281.html; Package: 0805; Supplier: LC; SuppliersPartNumber: C17593
R115 = 0805 27Ω (27R0) 1%: 贴片电阻; ComponentLink1Description: 供应商链接; ComponentLink1URL: http://www.szlcsc.com/product/details_18282.html; Package: 0805; Supplier: LC; SuppliersPartNumber: C17594
R116 = 0805 2KΩ (2001) 1%: 贴片电阻; ComponentLink1Description: 供应商链接; ComponentLink1URL: http://www.szlcsc.com/product/details_18292.html; Package: 0805; Supplier: LC; SuppliersPartNumber: C17604
R117 = 0805 2MΩ (2004) 1%: 贴片电阻; ComponentLink1Description: 供应商链接; ComponentLink1URL: http://www.szlcsc.com/product/details_26855.html; Package: 0805; Supplier: LC; SuppliersPartNumber: C26112
R118 = 0805 2Ω (2R00) 1%: 贴片电阻; ComponentLink1Description: 供应商链接; ComponentLink1URL: http://www.szlcsc.com/product/details_18294.html; Package: 0805; Supplier: LC; SuppliersPartNumber: C17606
R119 = 0805 3.3KΩ (3301) 1%: 贴片电阻; ComponentLink1Description: 供应商链接; ComponentLink1URL: http://www.szlcsc.com/product/details_26753.html; Package: 0805; Supplier: LC; SuppliersPartNumber: C26010
R120 = 0805 3.6KΩ (3601) 1%: 贴片电阻; ComponentLink1Description: 供应商链接; ComponentLink1URL: http://www.szlcsc.com/product/details_19056.html; Package: 0805; Supplier: LC; SuppliersPartNumber: C18359
R121 = 0805 3.9KΩ (3901) 1%: 贴片电阻; ComponentLink1Description: 供应商链接; ComponentLink1URL: http://www.szlcsc.com/product/details_18302.html; Package: 0805; Supplier: LC; SuppliersPartNumber: C17614
R122 = 0805 300KΩ (3003) 1%: 贴片电阻; ComponentLink1Description: 供应商链接; ComponentLink1URL: http://www.szlcsc.com/product/details_18304.html; Package: 0805; Supplier: LC; SuppliersPartNumber: C17616
R123 = 0805 300Ω (3000) 1%: 贴片电阻; ComponentLink1Description: 供应商链接; ComponentLink1URL: http://www.szlcsc.com/product/details_18305.html; Package: 0805; Supplier: LC; SuppliersPartNumber: C17617
R124 = 0805 330KΩ (3303) 1%: 贴片电阻; ComponentLink1Description: 供应商链接; ComponentLink1URL: http://www.szlcsc.com/product/details_18317.html; Package: 0805; Supplier: LC; SuppliersPartNumber: C17629
R125 = 0805 330Ω (3300) 1%: 贴片电阻; ComponentLink1Description: 供应商链接; ComponentLink1URL: http://www.szlcsc.com/product/details_18318.html; Package: 0805; Supplier: LC; SuppliersPartNumber: C17630
R126 = 0805 33KΩ (3302) 1%: 贴片电阻; ComponentLink1Description: 供应商链接; ComponentLink1URL: http://www.szlcsc.com/product/details_18321.html; Package: 0805; Supplier: LC; SuppliersPartNumber: C17633
R127 = 0805 33Ω (33R0) 1%: 贴片电阻; ComponentLink1Description: 供应商链接; ComponentLink1URL: http://www.szlcsc.com/product/details_18322.html; Package: 0805; Supplier: LC; SuppliersPartNumber: C17634
R128 = 0805 36KΩ (3602) 1%: 贴片电阻; ComponentLink1Description: 供应商链接; ComponentLink1URL: http://www.szlcsc.com/product/details_4767.html; Package: 0805; Supplier: LC; SuppliersPartNumber: C4360
R129 = 0805 390KΩ (3903) 1%: 贴片电阻; ComponentLink1Description: 供应商链接; ComponentLink1URL: http://www.szlcsc.com/product/details_18344.html; Package: 0805; Supplier: LC; SuppliersPartNumber: C17656
R130 = 0805 390Ω (3900) 1%: 贴片电阻; ComponentLink1Description: 供应商链接; ComponentLink1URL: http://www.szlcsc.com/product/details_18343.html; Package: 0805; Supplier: LC; SuppliersPartNumber: C17655
R131 = 0805 39KΩ (3902) 1%: 贴片电阻; ComponentLink1Description: 供应商链接; ComponentLink1URL: http://www.szlcsc.com/product/details_26569.html; Package: 0805; Supplier: LC; SuppliersPartNumber: C25826
R132 = 0805 3KΩ (3001) 1%: 贴片电阻; ComponentLink1Description: 供应商链接; ComponentLink1URL: http://www.szlcsc.com/product/details_18349.html; Package: 0805; Supplier: LC; SuppliersPartNumber: C17661
R133 = 0805 3MΩ (305) 5%: 贴片电阻; ComponentLink1Description: 供应商链接; ComponentLink1URL: http://www.szlcsc.com/product/details_26860.html; Package: 0805; Supplier: LC; SuppliersPartNumber: C26117
R134 = 0805 4.3KΩ (4301) 1%: 贴片电阻; ComponentLink1Description: 供应商链接; ComponentLink1URL: http://www.szlcsc.com/product/details_18355.html; Package: 0805; Supplier: LC; SuppliersPartNumber: C17667
R135 = 0805 4.7KΩ (4701) 1%: 贴片电阻; ComponentLink1Description: 供应商链接; ComponentLink1URL: http://www.szlcsc.com/product/details_18361.html; Package: 0805; Supplier: LC; SuppliersPartNumber: C17673
R136 = 0805 4.7MΩ (4704) 1%: 贴片电阻; ComponentLink1Description: 供应商链接; ComponentLink1URL: http://www.szlcsc.com/product/details_18362.html; Package: 0805; Supplier: LC; SuppliersPartNumber: C17674
R137 = 0805 4.7Ω (4R70) 1%: 贴片电阻; ComponentLink1Description: 供应商链接; ComponentLink1URL: http://www.szlcsc.com/product/details_18363.html; Package: 0805; Supplier: LC; SuppliersPartNumber: C17675
R138 = 0805 4.99KΩ (4991) 1%: 贴片电阻; ComponentLink1Description: 供应商链接; ComponentLink1URL: http://www.szlcsc.com/product/details_18365.html; Package: 0805; Supplier: LC; SuppliersPartNumber: C17677
R139 = 0805 40.2KΩ (4022) 1%: 贴片电阻; ComponentLink1Description: 供应商链接; ComponentLink1URL: http://www.szlcsc.com/product/details_18366.html; Package: 0805; Supplier: LC; SuppliersPartNumber: C17678
R140 = 0805 43KΩ (4302) 1%: 贴片电阻; ComponentLink1Description: 供应商链接; ComponentLink1URL: http://www.szlcsc.com/product/details_18383.html; Package: 0805; Supplier: LC; SuppliersPartNumber: C17695
R141 = 0805 470KΩ (4703) 1%: 贴片电阻; ComponentLink1Description: 供应商链接; ComponentLink1URL: http://www.szlcsc.com/product/details_18397.html; Package: 0805; Supplier: LC; SuppliersPartNumber: C17709
R142 = 0805 470Ω (4700) 1%: 贴片电阻; ComponentLink1Description: 供应商链接; ComponentLink1URL: http://www.szlcsc.com/product/details_18398.html; Package: 0805; Supplier: LC; SuppliersPartNumber: C17710
R143 = 0805 47KΩ (4702) 1%: 贴片电阻; ComponentLink1Description: 供应商链接; ComponentLink1URL: http://www.szlcsc.com/product/details_18401.html; Package: 0805; Supplier: LC; SuppliersPartNumber: C17713
R144 = 0805 47Ω (47R0) 1%: 贴片电阻; ComponentLink1Description: 供应商链接; ComponentLink1URL: http://www.szlcsc.com/product/details_18402.html; Package: 0805; Supplier: LC; SuppliersPartNumber: C17714
R145 = 0805 49.9KΩ (4992) 1%: 贴片电阻; ComponentLink1Description: 供应商链接; ComponentLink1URL: http://www.szlcsc.com/product/details_18407.html; Package: 0805; Supplier: LC; SuppliersPartNumber: C17719
R146 = 0805 49.9Ω (49R9) 1%: 贴片电阻; ComponentLink1Description: 供应商链接; ComponentLink1URL: http://www.szlcsc.com/product/details_18408.html; Package: 0805; Supplier: LC; SuppliersPartNumber: C17720
R147 = 0805 5.1KΩ (5101) 1%: 贴片电阻; ComponentLink1Description: 供应商链接; ComponentLink1URL: http://www.szlcsc.com/product/details_28584.html; Package: 0805; Supplier: LC; SuppliersPartNumber: C27834
R148 = 0805 5.1MΩ (5104) 1%: 贴片电阻; ComponentLink1Description: 供应商链接; ComponentLink1URL: http://www.szlcsc.com/product/details_26857.html; Package: 0805; Supplier: LC; SuppliersPartNumber: C26114
R149 = 0805 5.1Ω (5R10) 1%: 贴片电阻; ComponentLink1Description: 供应商链接; ComponentLink1URL: http://www.szlcsc.com/product/details_18412.html; Package: 0805; Supplier: LC; SuppliersPartNumber: C17724
R150 = 0805 5.6KΩ (5601) 1%: 贴片电阻; ComponentLink1Description: 供应商链接; ComponentLink1URL: http://www.szlcsc.com/product/details_4789.html; Package: 0805; Supplier: LC; SuppliersPartNumber: C4382
R151 = 0805 510KΩ (5103) 1%: 贴片电阻; ComponentLink1Description: 供应商链接; ComponentLink1URL: http://www.szlcsc.com/product/details_18421.html; Package: 0805; Supplier: LC; SuppliersPartNumber: C17733
R152 = 0805 510Ω (5100) 1%: 贴片电阻; ComponentLink1Description: 供应商链接; ComponentLink1URL: http://www.szlcsc.com/product/details_18422.html; Package: 0805; Supplier: LC; SuppliersPartNumber: C17734
R153 = 0805 51KΩ (5102) 1%: 贴片电阻; ComponentLink1Description: 供应商链接; ComponentLink1URL: http://www.szlcsc.com/product/details_18425.html; Package: 0805; Supplier: LC; SuppliersPartNumber: C17737
R154 = 0805 51Ω (51R0) 1%: 贴片电阻; ComponentLink1Description: 供应商链接; ComponentLink1URL: http://www.szlcsc.com/product/details_18426.html; Package: 0805; Supplier: LC; SuppliersPartNumber: C17738
R155 = 0805 560KΩ (5603) 1%: 贴片电阻; ComponentLink1Description: 供应商链接; ComponentLink1URL: http://www.szlcsc.com/product/details_16467.html; Package: 0805; Supplier: LC; SuppliersPartNumber: C15785
R156 = 0805 560Ω (5600) 1%: 贴片电阻; ComponentLink1Description: 供应商链接; ComponentLink1URL: http://www.szlcsc.com/product/details_29388.html; Package: 0805; Supplier: LC; SuppliersPartNumber: C28636
R157 = 0805 56KΩ (5602) 1%: 贴片电阻; ComponentLink1Description: 供应商链接; ComponentLink1URL: http://www.szlcsc.com/product/details_18444.html; Package: 0805; Supplier: LC; SuppliersPartNumber: C17756
R158 = 0805 56Ω (56R0) 1%: 贴片电阻; ComponentLink1Description: 供应商链接; ComponentLink1URL: http://www.szlcsc.com/product/details_18445.html; Package: 0805; Supplier: LC; SuppliersPartNumber: C17757
R159 = 0805 6.2KΩ (6201) 1%: 贴片电阻; ComponentLink1Description: 供应商链接; ComponentLink1URL: http://www.szlcsc.com/product/details_18455.html; Package: 0805; Supplier: LC; SuppliersPartNumber: C17767
R160 = 0805 6.8KΩ (6801) 1%: 贴片电阻; ComponentLink1Description: 供应商链接; ComponentLink1URL: http://www.szlcsc.com/product/details_18460.html; Package: 0805; Supplier: LC; SuppliersPartNumber: C17772
R161 = 0805 62KΩ (6202) 1%: 贴片电阻; ComponentLink1Description: 供应商链接; ComponentLink1URL: http://www.szlcsc.com/product/details_18471.html; Package: 0805; Supplier: LC; SuppliersPartNumber: C17783
R162 = 0805 680KΩ (6803) 1%: 贴片电阻; ComponentLink1Description: 供应商链接; ComponentLink1URL: http://www.szlcsc.com/product/details_18485.html; Package: 0805; Supplier: LC; SuppliersPartNumber: C17797
R163 = 0805 680Ω (6800) 1%: 贴片电阻; ComponentLink1Description: 供应商链接; ComponentLink1URL: http://www.szlcsc.com/product/details_18486.html; Package: 0805; Supplier: LC; SuppliersPartNumber: C17798
R164 = 0805 68KΩ (6802) 1%: 贴片电阻; ComponentLink1Description: 供应商链接; ComponentLink1URL: http://www.szlcsc.com/product/details_18489.html; Package: 0805; Supplier: LC; SuppliersPartNumber: C17801
R165 = 0805 68Ω (68R0) 1%: 贴片电阻; ComponentLink1Description: 供应商链接; ComponentLink1URL: http://www.szlcsc.com/product/details_18490.html; Package: 0805; Supplier: LC; SuppliersPartNumber: C17802
R166 = 0805 7.5KΩ (7501) 1%: 贴片电阻; ComponentLink1Description: 供应商链接; ComponentLink1URL: http://www.szlcsc.com/product/details_18495.html; Package: 0805; Supplier: LC; SuppliersPartNumber: C17807
R167 = 0805 750Ω (7500) 1%: 贴片电阻; ComponentLink1Description: 供应商链接; ComponentLink1URL: http://www.szlcsc.com/product/details_18506.html; Package: 0805; Supplier: LC; SuppliersPartNumber: C17818
R168 = 0805 75KΩ (7502) 1%: 贴片电阻; ComponentLink1Description: 供应商链接; ComponentLink1URL: http://www.szlcsc.com/product/details_18507.html; Package: 0805; Supplier: LC; SuppliersPartNumber: C17819
R169 = 0805 75Ω (75R0) 1%: 贴片电阻; ComponentLink1Description: 供应商链接; ComponentLink1URL: http://www.szlcsc.com/product/details_21350.html; Package: 0805; Supplier: LC; SuppliersPartNumber: C20638
R170 = 0805 8.2KΩ (8201) 1%: 贴片电阻; ComponentLink1Description: 供应商链接; ComponentLink1URL: http://www.szlcsc.com/product/details_18516.html; Package: 0805; Supplier: LC; SuppliersPartNumber: C17828
R171 = 0805 820Ω (8200) 1%: 贴片电阻; ComponentLink1Description: 供应商链接; ComponentLink1URL: http://www.szlcsc.com/product/details_18525.html; Package: 0805; Supplier: LC; SuppliersPartNumber: C17837
R172 = 0805 82KΩ (8202) 1%: 贴片电阻; ComponentLink1Description: 供应商链接; ComponentLink1URL: http://www.szlcsc.com/product/details_18528.html; Package: 0805; Supplier: LC; SuppliersPartNumber: C17840
R173 = 0805 82Ω (82R0) 1%: 贴片电阻; ComponentLink1Description: 供应商链接; ComponentLink1URL: http://www.szlcsc.com/product/details_18529.html; Package: 0805; Supplier: LC; SuppliersPartNumber: C17841
R174 = 0805 9.1KΩ (9101) 1%: 贴片电阻; ComponentLink1Description: 供应商链接; ComponentLink1URL: http://www.szlcsc.com/product/details_18543.html; Package: 0805; Supplier: LC; SuppliersPartNumber: C17855
R175 = 0805 91KΩ (9102) 1%: 贴片电阻; ComponentLink1Description: 供应商链接; ComponentLink1URL: http://www.szlcsc.com/product/details_18554.html; Package: 0805; Supplier: LC; SuppliersPartNumber: C17866
R176 = 1206 0.1Ω (R100) 1%: 贴片电阻; ComponentLink1Description: 供应商链接; ComponentLink1URL: http://www.szlcsc.com/product/details_26077.html; Package: 1206; Supplier: LC; SuppliersPartNumber: C25334
R177 = 1206 0Ω (0R0) 1%: 贴片电阻; ComponentLink1Description: 供应商链接; ComponentLink1URL: http://www.szlcsc.com/product/details_18576.html; Package: 1206; Supplier: LC; SuppliersPartNumber: C17888
R178 = 1206 1.2MΩ (1204) 1%: 贴片电阻; ComponentLink1Description: 供应商链接; ComponentLink1URL: http://www.szlcsc.com/product/details_22832.html; Package: 1206; Supplier: LC; SuppliersPartNumber: C22107
R179 = 1206 100KΩ (1003) 1%: 贴片电阻; ComponentLink1Description: 供应商链接; ComponentLink1URL: http://www.szlcsc.com/product/details_18588.html; Package: 1206; Supplier: LC; SuppliersPartNumber: C17900
R180 = 1206 100Ω (1000) 1%: 贴片电阻; ComponentLink1Description: 供应商链接; ComponentLink1URL: http://www.szlcsc.com/product/details_18589.html; Package: 1206; Supplier: LC; SuppliersPartNumber: C17901
R181 = 1206 10KΩ (1002) 1%: 贴片电阻; ComponentLink1Description: 供应商链接; ComponentLink1URL: http://www.szlcsc.com/product/details_18590.html; Package: 1206; Supplier: LC; SuppliersPartNumber: C17902
R182 = 1206 10Ω (10R0) 1%: 贴片电阻; ComponentLink1Description: 供应商链接; ComponentLink1URL: http://www.szlcsc.com/product/details_18591.html; Package: 1206; Supplier: LC; SuppliersPartNumber: C17903
R183 = 1206 180Ω (1800) 1%: 贴片电阻; ComponentLink1Description: 供应商链接; ComponentLink1URL: http://www.szlcsc.com/product/details_18612.html; Package: 1206; Supplier: LC; SuppliersPartNumber: C17924
R184 = 1206 1KΩ (1001) 1%: 贴片电阻; ComponentLink1Description: 供应商链接; ComponentLink1URL: http://www.szlcsc.com/product/details_4817.html; Package: 1206; Supplier: LC; SuppliersPartNumber: C4410
R185 = 1206 1Ω (1R00) 1%: 贴片电阻; ComponentLink1Description: 供应商链接; ComponentLink1URL: http://www.szlcsc.com/product/details_18616.html; Package: 1206; Supplier: LC; SuppliersPartNumber: C17928
R186 = 1206 20Ω (20R0) 1%: 贴片电阻; ComponentLink1Description: 供应商链接; ComponentLink1URL: http://www.szlcsc.com/product/details_18643.html; Package: 1206; Supplier: LC; SuppliersPartNumber: C17955
R187 = 1206 22Ω (22R0) 1%: 贴片电阻; ComponentLink1Description: 供应商链接; ComponentLink1URL: http://www.szlcsc.com/product/details_18646.html; Package: 1206; Supplier: LC; SuppliersPartNumber: C17958
R188 = 1206 2KΩ (2001) 1%: 贴片电阻; ComponentLink1Description: 供应商链接; ComponentLink1URL: http://www.szlcsc.com/product/details_18632.html; Package: 1206; Supplier: LC; SuppliersPartNumber: C17944
R189 = 1206 300Ω (3000) 1%: 贴片电阻; ComponentLink1Description: 供应商链接; ComponentLink1URL: http://www.szlcsc.com/product/details_18575.html; Package: 1206; Supplier: LC; SuppliersPartNumber: C17887
R190 = 1206 4.7KΩ (4701) 1%: 贴片电阻; ComponentLink1Description: 供应商链接; ComponentLink1URL: http://www.szlcsc.com/product/details_18624.html; Package: 1206; Supplier: LC; SuppliersPartNumber: C17936
R191 = 1206 750Ω (7500) 1%: 贴片电阻; ComponentLink1Description: 供应商链接; ComponentLink1URL: http://www.szlcsc.com/product/details_18673.html; Package: 1206; Supplier: LC; SuppliersPartNumber: C17985